# EAGLE design SalinityExpansion (EAGLE 6.1)
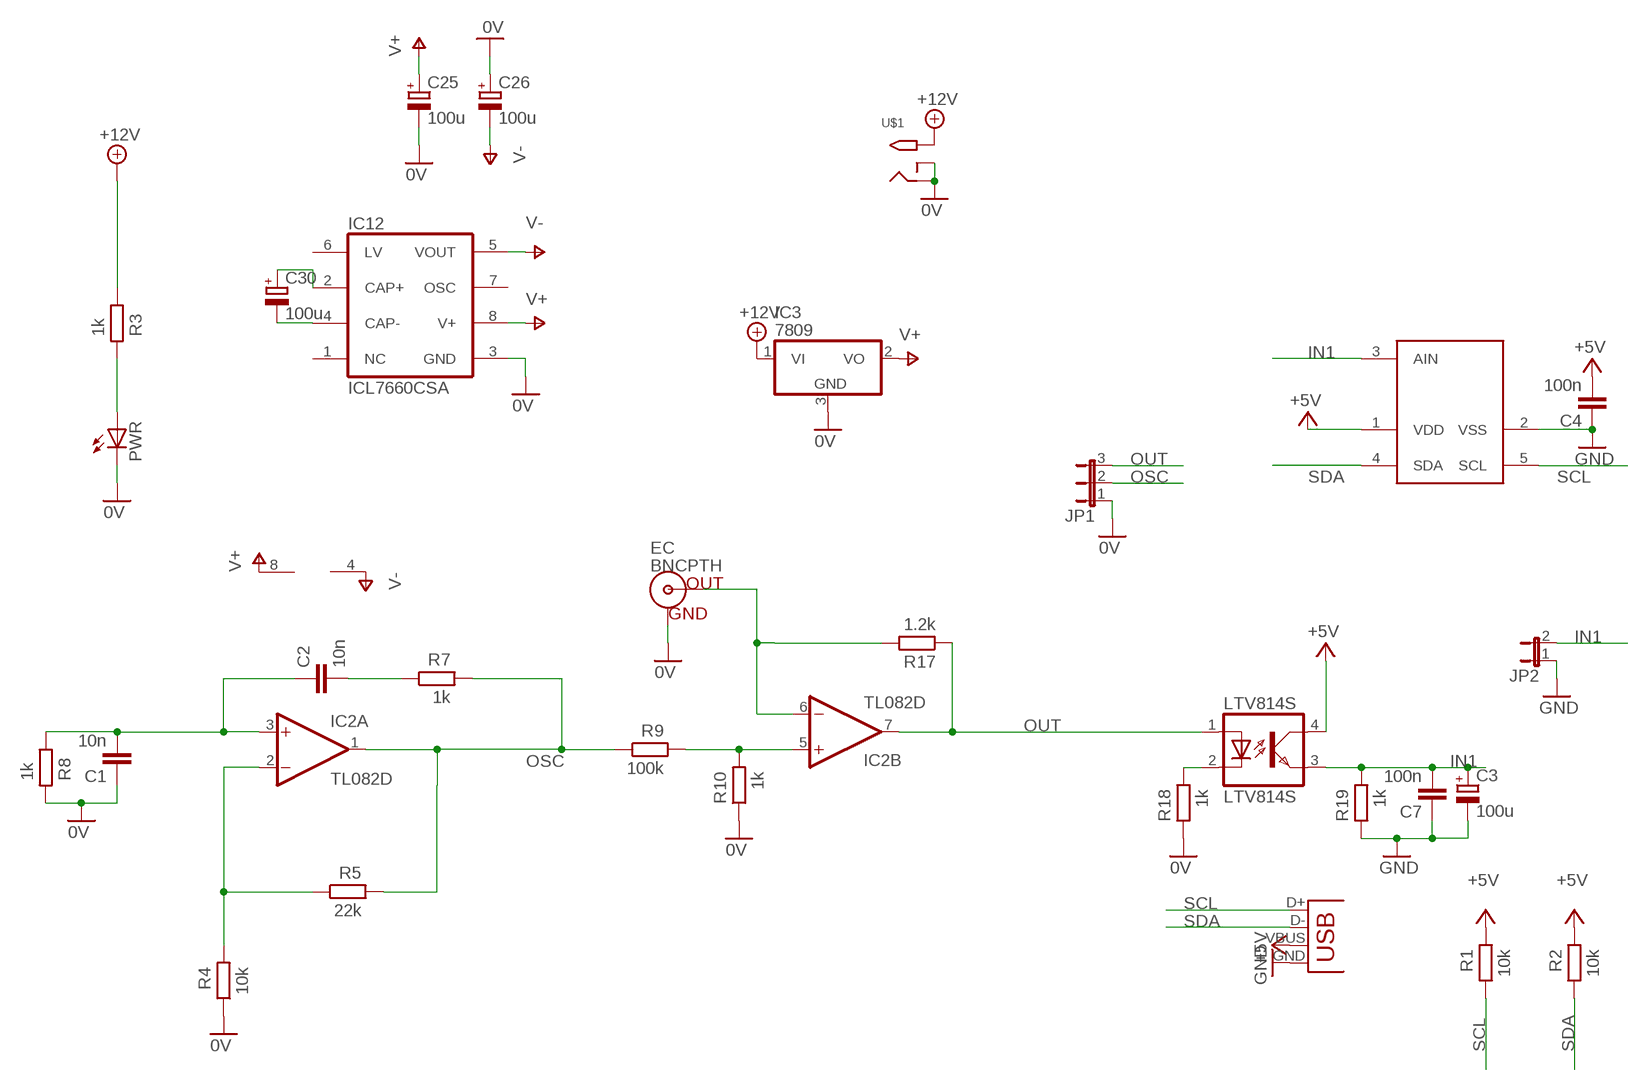
[diagram p0: schematic, sheet 1]

## Parts
C1  10n  C-EUC0805K  [C0805K]
C2  10n  C-EUC0805K  [C0805K]
C3  100u  CPOL-EUD  [PANASONIC_D]
C4  100n  C-EUC0805K  [C0805K]
C7  100n  C-EUC0805K  [C0805K]
C25  100u  CPOL-EUD  [PANASONIC_D]
C26  100u  CPOL-EUD  [PANASONIC_D]
C30  100u  CPOL-EUD  [PANASONIC_D]
EC  BNCPTH  [BNC]
IC2  TL082D  [SO08]
IC3  7809  7805DT  [TO252]
IC12  ICL7660CSA  [SO08]
JP1  JP2E  [JP2]
JP2  JP1E  [JP1]
LTV814S  LTV814S  LTV816S  [SMD4]
PWR  LED3MM  [LED3MM]
R1  10k  R-EU_R0805  [R0805]
R2  10k  R-EU_R0805  [R0805]
R3  1k  R-EU_R0805  [R0805]
R4  10k  R-EU_R0805  [R0805]
R5  22k  R-EU_R0805  [R0805]
R7  1k  R-EU_R0805  [R0805]
R8  1k  R-EU_R0805  [R0805]
R9  100k  R-EU_R0805  [R0805]
R10  1k  R-EU_R0805  [R0805]
R17  1.2k  R-EU_R0805  [R0805]
R18  1k  R-EU_R0805  [R0805]
R19  1k  R-EU_R0805  [R0805]
U$1  2.1MMJACKTHM  [PJ-102A]
U$2  MCP3221  [SOT23-5]
X5  USBSMD  [USB-MINIB]

## Nets
0V: C1.1 C25.- C26.+ EC.GND IC3.3(GND) IC12.3(GND) JP1.1 PWR.K(C) R4.1 R8.2 R10.1 R18.1 U$1.RING U$1.RING_SW
+5V: C4.2 LTV814S.4(COL) R1.2 R2.2 U$2.1(VDD) X5.VBUS
+12V: IC3.1(VI) R3.1 U$1.TIP
GND [gnd]: C3.- C4.1 C7.1 JP2.1 R19.1 U$2.2(VSS) X5.GND
IN1: C3.+ C7.2 JP2.2 LTV814S.3(EMIT) R19.2 U$2.3(AIN)
N$4: IC2.2(A:-IN) R4.2 R5.1
N$8: IC2.5(B:+IN) R9.2 R10.2
N$9: C2.2 R7.1
N$10: PWR.A R3.2
N$11: EC.S(OUT) IC2.6(B:-IN) R17.2
N$12: C1.2 C2.1 IC2.3(A:+IN) R8.1
N$18: LTV814S.2(C) R18.2
N$42: C30.- IC12.4(CAP-)
N$43: C30.+ IC12.2(CAP+)
OSC: IC2.1(A:OUT) JP1.2 R5.2 R7.2 R9.1
OUT: IC2.7(B:OUT) JP1.3 LTV814S.1(A) R17.1
SCL: R1.1 U$2.5(SCL) X5.D+
SDA: R2.1 U$2.4(SDA) X5.D-
V+: C25.+ IC2.8(P:V+) IC3.2(VO) IC12.8(V+)
V-: C26.- IC2.4(P:V-) IC12.5(VOUT)
Unconnected: IC12.1(NC) IC12.6(LV) IC12.7(OSC)

## Library data of the parts
C1 C2 C4 C7 = rcl:C-EU: CAPACITOR, European symbol
C3 C25 C26 C30 = rcl:CPOL-EU: POLARIZED CAPACITOR, European symbol
EC = SparkFun:BNC: BNC Connector, Mouser Part# 5227161
IC2 = linear:TL082: OP AMP
IC3 = adafruit:78*: Positive VOLTAGE REGULATOR Added bigger pads to the TO-92 package
IC12 = maxim:ICL7660CSA: VOLTAGE CONVERTER; MF: MAXIM; MPN: ICL7660CSA; OC_FARNELL: 9724710; OC_NEWARK: 34C3732
JP1 = jumper:JP2E: JUMPER
JP2 = jumper:JP1E: JUMPER
LTV814S = optocoupler:LTV816: OPTO COUPLER Source: LITEON, LTV816.pdf; OC_FARNELL: unknown; OC_NEWARK: unknown
PWR = led:LED: LED OSRAM: - CHIPLED LG R971, LG N971, LY N971, LG Q971, LY Q971, LO R971, LY R971 LH N974, LH R974 LS Q976, LO Q976, LY Q976 LO Q996 - Hyper CHIPLED LW Q18S LB Q993, LB Q99A, LB R99A - SideLED LS A670, LO A670, LY A670, LG A670, LP A670 LB A673, LV A673, LT A673, LW A673 LH A674 LY A675 LS A676, LA A676, LO A676, LY A676, LW A676 LS A679, LY A679, LG A679 - Hyper Micro SIDELED® LS Y876, LA Y876, LO Y876, LY Y876 LT Y87S - SmartLED LW L88C, LW L88S LB L89C, LB L89S, LG L890 LS L89K, LO L89K, LY L89K LS L896, LA L896, LO L896, LY L896 - TOPLED LS T670, LO T670, LY T670, LG T670, LP T670 LSG T670, LSP T670, LSY T670, LOP T670, LYG T670 LG T671, LOG T671, LSG T671 LB T673, LV T673, LT T673, LW T673 LH T674 LS T676, LA T676, LO T676, LY T676, LB T676, LH T676, LSB T676, LW T676 LB T67C, LV T67C, LT T67C, LS T67K, LO T67K, LY T67K, LW E67C LS E67B, LA E67B, LO E67B, LY E67B, LB E67C, LV E67C, LT E67C LW T67C LS T679, LY T679, LG T679 LS T770, LO T770, LY T770, LG T770, LP T770 LB T773, LV T773, LT T773, LW T773 LH T774 LS E675, LA E675, LY E675, LS T675 LS T776, LA T776, LO T776, LY T776, LB T776 LHGB T686 LT T68C, LB T68C - Hyper Mini TOPLED® LB M676 - Mini TOPLED Santana® LG M470 LS M47K, LO M47K, LY M47K Source: http://www.osram.convergy.de LUXEON: - LUMILED® LXK2-PW12-R00, LXK2-PW12-S00, LXK2-PW14-U00, LXK2-PW14-V00 LXK2-PM12-R00, LXK2-PM12-S00, LXK2-PM14-U00 LXK2-PE12-Q00, LXK2-PE12-R00, LXK2-PE12-S00, LXK2-PE14-T00, LXK2-PE14-U00 LXK2-PB12-K00, LXK2-PB12-L00, LXK2-PB12-M00, LXK2-PB14-N00, LXK2-PB14-P00, LXK2-PB14-Q00 LXK2-PR12-L00, LXK2-PR12-M00, LXK2-PR14-Q00, LXK2-PR14-R00 LXK2-PD12-Q00, LXK2-PD12-R00, LXK2-PD12-S00 LXK2-PH12-R00, LXK2-PH12-S00 LXK2-PL12-P00, LXK2-PL12-Q00, LXK2-PL12-R00 Source: www.luxeon.com KINGBRIGHT: KA-3528ASYC Source: www.kingbright.com
R1-R5 R7-R10 R17-R19 = rcl:R-EU_: RESISTOR, European symbol
U$1 = adafruit:2.1MMJACK: 2.1mm x 5.5mm THM DC jack with internal switch. Digikey part #PJ-102A, 4UCON part #05537 2.1mm x 5.5mm SMT DC jack with internal switch. Digikey part #PJ-002A-SMT, 4UCON part #03267 By microbuilder.eu & adafruit.com
U$2 = MCP3426:MCP3221
X5 = SparkFun:USB: USB Connectors USB-B-PTH is fully proven SKU : PRT-00139 USB-miniB is fully proven SKU : PRT-00587 USB-A-PCB is untested. USB-A-H is throughly reviewed, but untested. Spark Fun Electronics SKU : PRT-00437 USB-B-SMT is throughly reviewed, but untested. Needs silkscreen touching up. USB-A-S has not been used/tested USB-MB-H has not been used/tested

## Net classes
0 default: width 0.305 mm, drill 0.305 mm, clearance 0.203 mm
1 power: width 0.254 mm, drill 0.254 mm, clearance 0.229 mm
2 gnd: width 0.305 mm, drill 0.508 mm, clearance 0.203 mm

## Board
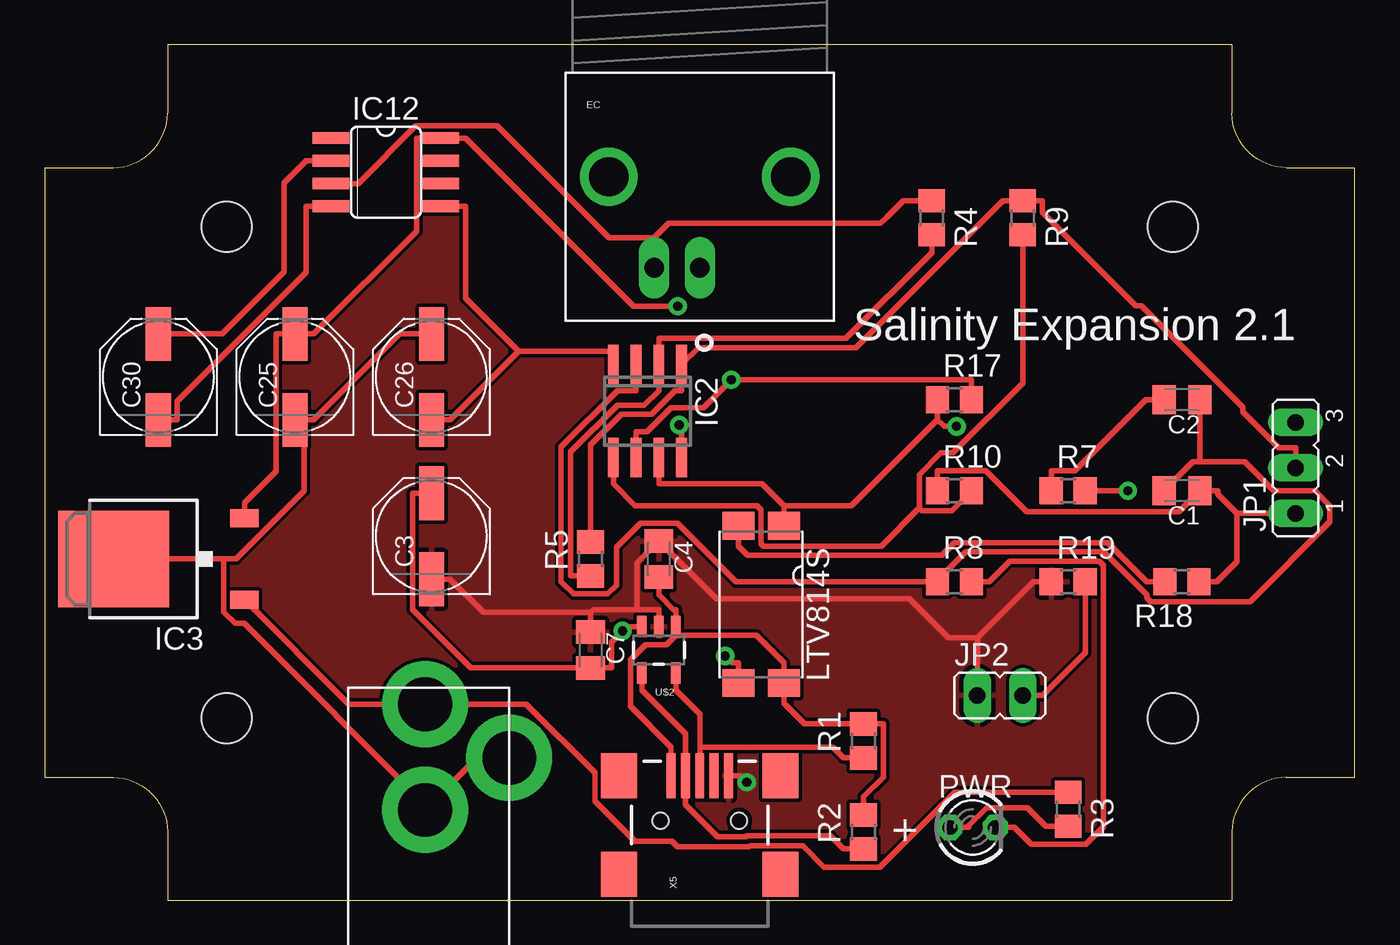
[diagram p1: board, top side]
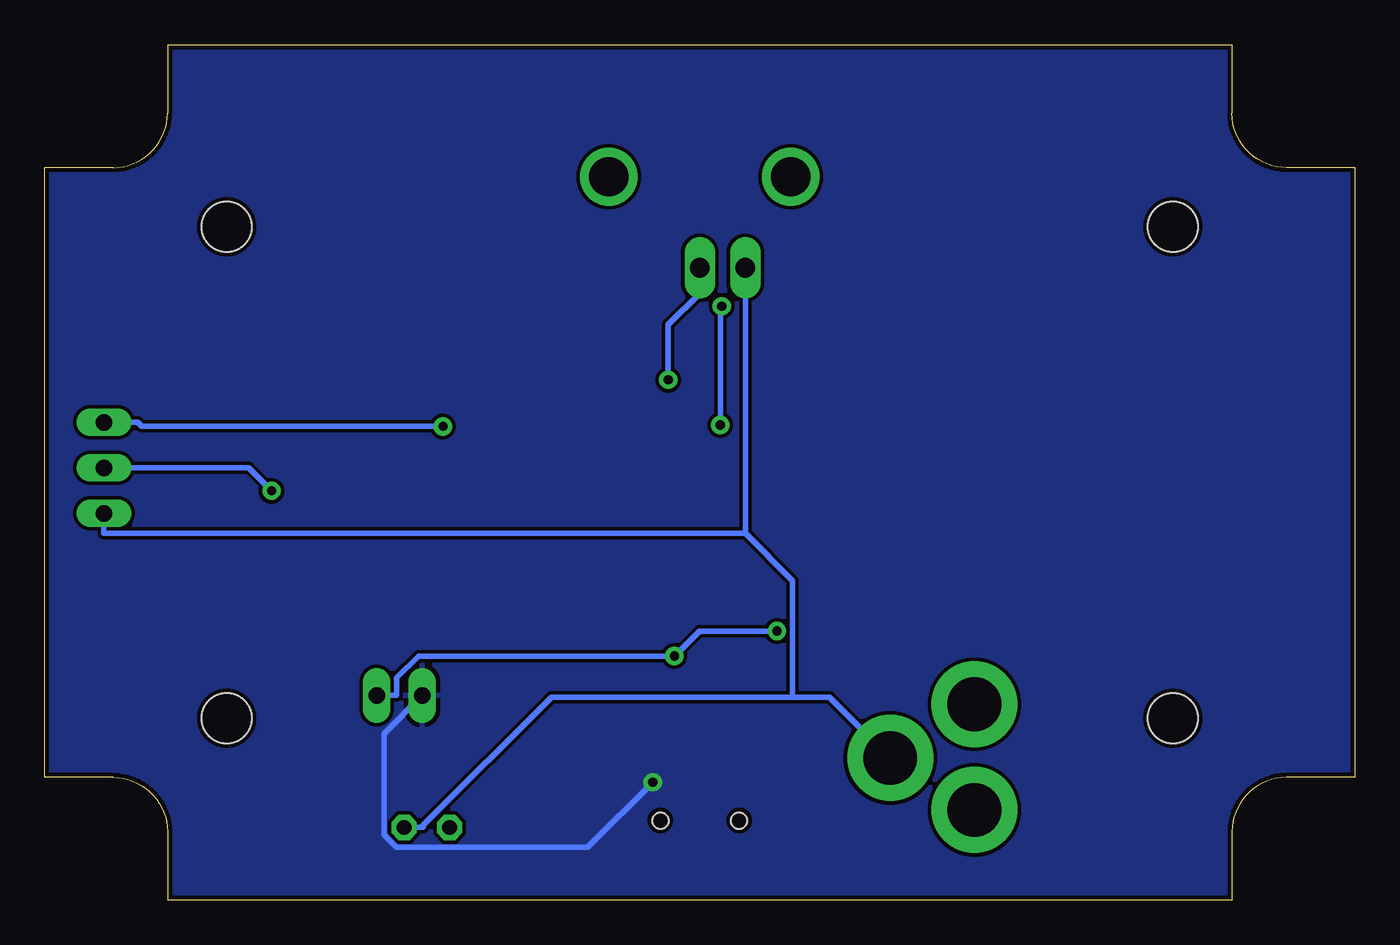
[diagram p2: board, bottom side, seen from below]

Size 73.15 x 47.75 mm. Coordinates in mm from the lower left corner, seen from the top.
Outline: 0,40.89 0,6.86 3.81,6.86 arc-90 6.86,3.81 6.86,0 66.29,0 66.29,3.81 arc-90 69.34,6.86 73.15,6.86 73.15,40.89 69.34,40.89 arc-90 66.29,43.94 66.29,47.75 6.86,47.75 6.86,43.94 arc-90 3.81,40.89 0,40.89
Copper layers (1*16): Top 0.035mm / dielectric 1.5mm / Bottom 0.035mm
Design rules: minimum track width 8mil, minimum drill 20mil, track to track 8mil, track to pad 8mil, pad to pad 8mil, via to via 8mil, smd to smd 8mil, copper to edge 10mil, drill to drill 8mil, minimum pad ring 12mil, minimum via ring 10mil, stop-mask expansion 4mil, vias tented up to drill 25mil, thermal gap 10mil
Holes 2.8 mm at 10.16,10.16 10.16,37.59 62.99,37.59 62.99,10.16

### Footprints (pad centres in the part's own frame; a part is rotated, then mirrored left to right if it is on the bottom)
C0805K = smd 1.3 x 1.6: 1 -1,0; 2 1,0
PANASONIC_D = smd 3 x 1.4: + 2.4,0; - -2.4,0
BNC = drill 2.2: 3 -5.08,5.08; 4 5.08,5.08 | drill 1.1 long: GND -2.54,0; S 0,0
SO08 = smd 0.6 x 2.2: 1 -1.905,-2.6; 2 -0.635,-2.6; 3 0.635,-2.6; 4 1.905,-2.6; 5 1.905,2.6; 6 0.635,2.6; 7 -0.635,2.6; 8 -1.905,2.6
TO252 = smd 1 x 1.6: 1 -2.28,-4.8; 2 2.28,-4.8 | smd 5.4 x 6.2: 3 0,2.5
SO08' = smd 0.66 x 2.032: 1 -1.905,-3.073; 2 -0.635,-3.073; 3 0.635,-3.073; 4 1.905,-3.073; 5 1.905,3.073; 6 0.635,3.073; 7 -0.635,3.073; 8 -1.905,3.073
JP2 = drill 0.914 long: 1 -2.54,0; 2 0,0; 3 2.54,0
JP1 = drill 0.914 long: 1 0,-1.27; 2 0,1.27
SMD4 = smd 1.78 x 1.55: 1 -1.27,-4.389; 2 1.27,-4.389; 3 1.27,4.389; 4 -1.27,4.389
LED3MM = drill 0.813 octagon: A -1.27,0; K 1.27,0
R0805 = smd 1.3 x 1.5: 1 -0.95,0; 2 0.95,0
PJ-102A = drill 3 pad 4.8: RING 0.1,-3.39; RING_SW -4.6,-6.29; TIP 0.1,-9.29
SOT23-5 = smd 0.55 x 1.2: 1 -0.95,-1.3; 2 0,-1.3; 3 0.95,-1.3; 4 0.95,1.3; 5 -0.95,1.3
USB-MINIB = smd 2.5 x 0.5: D+ 2.5,0; D- 2.5,0.8; GND 2.5,-1.6; ID 2.5,-0.8; VBUS 2.5,1.6 | smd 2.5 x 2: GND@1 -3,-4.5; GND@2 -3,4.5; GND@3 2.5,4.5; GND@4 2.5,-4.5 | hole 0.9: 0,2.2; 0,-2.2

### Placement (x,y rotation side)
C1  63.5,22.86 180 top
C2  63.5,27.94 180 top
C3  21.59,20.32 90 top
C4  34.29,19.05 270 top
C7  30.48,13.97 270 top
C25  13.97,29.21 90 top
C26  21.59,29.21 90 top
C30  6.35,29.21 90 top
EC  36.58,35.31 0 top
IC2  33.66,27.3 180 top
IC3  6.35,19.05 90 top
IC12  ICL7660CSA  [SO08']  19.05,40.64 270 top
JP1  69.85,24.13 90 top
JP2  53.34,11.43 270 top
LTV814S  40.01,16.51 180 top
PWR  51.82,4.06 0 top
R1  45.72,8.89 90 top
R2  45.72,3.81 90 top
R3  57.15,5.08 270 top
R4  49.53,38.1 270 top
R5  30.48,19.05 90 top
R7  57.15,22.86 0 top
R8  50.8,17.78 0 top
R9  54.61,38.1 270 top
R10  50.8,22.86 0 top
R17  50.8,27.94 0 top
R18  63.5,17.78 180 top
R19  57.15,17.78 0 top
U$1  21.34,1.65 180 top
U$2  34.29,13.97 180 top
X5  36.58,4.45 90 top

### Tracks (layer width: path | path; a pad name or v marks a point on that pad's centre or on a via)
0V
  Top 0.305: PWR.K 54.15,4.06 55.09,3.12 58.14,3.12 59.11,4.09 59.11,18.7 58.9,18.91 53.89,18.91 52.76,17.78 R8.2 | R10.1 49.85,23.97 52.56,23.97 54.84,21.68 63.32,21.68 C1.1 65.51,22.86 65.51,22.65 66.56,21.59 | 66.56,21.59 68.1,21.59 JP1.1 | 66.56,21.59 66.56,18.89 65.46,17.78 R18.1 | 9.99,19.05 IC3.3 | 14.5,26.81 14.5,22.86 10.69,19.05 9.99,19.05 | 21.38,5.19 11.13,15.45 10.62,15.45 9.99,16.08 9.99,19.05 | 21.38,5.19 U$1.RING | U$1.RING_SW 24.14,7.94 21.38,5.19 | 34.04,36.97 34.84,37.78 46.35,37.78 46.67,37.78 46.99,38.1 47.94,39.05 R4.1 | IC12.3 17.49,40.01 20.71,43.23 25.25,43.23 31.51,36.97 34.04,36.97 | EC.GND 34.04,36.97 | 14.5,26.81 15.03,26.81 19.83,31.61 20.66,31.61 21.13,31.61 C26.+ | C25.- 14.5,26.81
  Bottom 0.305: 31.4,11.34 44.86,11.34 52.02,4.17 52.02,4.06 PWR.K | U$1.RING_SW 29.33,11.34 31.4,11.34 | 31.4,11.34 31.4,17.84 34.04,20.47 | 34.04,20.47 69.85,20.47 JP1.1 | 34.04,20.47 34.04,33.88 EC.GND
+5V
  Top 0.305: 35.24,14.79 39.73,14.79 41.27,13.25 LTV814S.4 41.27,10.99 42.42,9.84 R1.2 46.83,9.84 46.83,6.87 45.72,5.77 R2.2 | X5.VBUS 34.98,8.55 32.71,10.82 32.71,13.43 33.55,14.27 34.71,14.27 35.24,14.79 | 35.24,14.79 U$2.1 35.24,16.23 35.11,16.23 34.29,17.04 C4.2
+12V
  Top 0.305: IC3.1 16.98,10.94 U$1.TIP 26.89,10.94 30.72,7.11 30.72,5.52 32.96,3.28 35.03,3.28 35.34,2.97 39.33,2.97 39.4,3.05 42.33,3.05 43.52,1.85 46.64,1.85 50.82,6.03 R3.1
GND  (via drill 0.51 pad 1.02)
  Top 0.305: 33.07,16.23 30.63,16.23 30.48,16.07 | 33.07,16.23 34.29,16.23 U$2.2 | 33.07,16.23 33.07,18.83 C4.1 37.52,16.82 48.29,16.82 50.46,14.66 52.07,14.66 | 30.48,16.07 24.49,16.07 22.65,17.92 C3.- | 30.48,16.07 30.48,15.98 C7.1 | 52.07,14.66 55.19,17.78 R19.1 | JP2.1 52.07,14.66 | X5.GND 38.84,6.95 v39.2,6.58
  Bottom 0.305: v39.2,6.58 42.83,2.95 53.5,2.95 54.2,3.65 54.2,9.3 JP2.1
  pour Bottom: -2.54,53.34 77.47,53.34 77.47,-2.54 -2.54,-2.54
  pour Top: -1.27,52.07 74.93,52.07 74.93,-1.27 -1.27,-1.27
IN1  (via drill 0.51 pad 1.02)
  Top 0.305: v37.99,13.63 38.37,13.25 38.73,13.25 LTV814S.3 | U$2.3 32.51,15.27 v32.27,15.03 31.64,14.39 31.64,12.97 C7.2 23.78,12.97 20.53,16.22 20.53,22.72 C3.+ | JP2.2 55.73,11.43 58.1,13.8 R19.2
  Bottom 0.305: v32.27,15.03 36.6,15.03 v37.99,13.63 52.27,13.63 53.49,12.41 53.49,11.43 JP2.2
N$4
  Top 0.305: R5.1 29.37,18.1 29.37,25.04 31.97,27.63 33.47,27.63 34.29,28.45 IC2.2 34.29,31.36 44.75,31.36 49.53,36.14 R4.2
N$8
  Top 0.305: 48.84,21.9 48.84,23.76 50.05,24.97 50.72,24.97 54.61,28.86 R9.2 | R10.2 50.65,21.75 48.99,21.75 48.84,21.9 | 48.84,21.9 46.71,19.77 40.13,19.77 40.01,19.89 40.01,21.8 39.77,22.03 32.97,22.03 31.75,23.25 IC2.5
N$9
  Top 0.305: C2.2 61.49,27.94 57.52,23.97 56.2,23.97 R7.1
N$10
  Top 0.305: PWR.A 51.61,4.06 51.61,4.17 52.6,5.16 54.88,5.16 55.91,4.13 R3.2
N$11  (via drill 0.51 pad 1.02)
  Top 0.305: IC2.6 33.02,26.16 33.64,26.16 34.97,27.49 36.78,27.49 v38.34,29.05 51.75,29.05 R17.2
  Bottom 0.305: EC.S 36.58,33.88 38.34,32.12 v38.34,29.05
N$12
  Top 0.305: 64.5,24.48 67.01,24.48 68.63,22.86 70.94,22.86 71.77,22.03 71.77,21.13 67.31,16.67 61.75,16.67 61.54,16.88 61.54,17.05 59.15,19.45 51.44,19.45 49.85,17.86 R8.1 38.6,17.78 35.33,21.06 33.28,21.06 31.93,19.7 31.93,17.59 31.43,17.09 29.53,17.09 28.84,17.79 28.84,25.31 31.98,28.45 33.02,28.45 IC2.3 | C1.2 64.12,24.48 64.5,24.48 | 64.5,24.48 64.5,26.78 C2.1
N$18
  Top 0.305: LTV814S.2 38.73,19.77 39.24,19.26 50.09,19.26 50.79,19.96 59.37,19.96 61.54,17.78 R18.2
N$42
  Top 0.305: C30.- 7.41,26.81 7.41,27.87 14.61,35.06 14.61,38.73 IC12.4
N$43
  Top 0.305: IC12.2 14.61,41.27 13.37,40.04 13.37,35.08 9.91,31.61 C30.+
OSC  (via drill 0.51 pad 1.02)
  Top 0.305: R7.2 59.11,22.86 v60.49,22.86 | JP1.2 69.85,25.25 68.92,25.25 66.9,27.28 66.9,27.52 61.24,33.18 60.93,33.18 55.72,38.39 55.72,39.05 R9.1 54.06,39.05 53.5,39.05 45.31,30.85 36.51,30.85 IC2.1 35.56,28.45 35.21,28.45 33.88,27.12 32.19,27.12 30.48,25.41 30.48,21.01 R5.2
  Bottom 0.305: JP1.2 61.76,24.13 v60.49,22.86
OUT  (via drill 0.51 pad 1.02)
  Top 0.305: 41.27,22.03 40.05,23.25 34.29,23.25 IC2.7 | 49.85,26.83 45.05,22.03 41.27,22.03 | 49.85,26.83 50.24,26.45 v50.92,26.45 | R17.1 49.85,26.83 | LTV814S.1 41.27,22.03
  Bottom 0.305: v50.92,26.45 67.75,26.45 67.97,26.67 JP1.3
SCL
  Top 0.305: U$2.5 35.24,11.71 36.58,10.38 36.58,8.55 | R1.1 44.61,7.94 44,8.55 36.58,8.55 | X5.D+ 36.58,8.55
SDA
  Top 0.305: R2.1 44.61,2.86 43.88,3.59 39.22,3.59 39.17,3.54 37.58,3.54 35.78,5.34 X5.D- 35.78,9.28 33.34,11.71 U$2.4
V+  (via drill 0.51 pad 1.02)
  Top 0.305: v35.35,33.16 32.88,33.16 23.5,42.55 22.68,42.55 IC12.8 20.75,42.55 20.75,37.34 15.03,31.61 C25.+ 12.91,31.61 12.91,23.95 11.15,22.19 IC3.2 | v35.43,26.53 35.56,26.4 IC2.8
  Bottom 0.305: v35.43,26.53 35.43,33.08 v35.35,33.16
V-
  Top 0.305: IC12.5 23.5,38.73 23.5,33.61 26.47,30.63 | 26.47,30.63 22.65,26.81 C26.- | 26.47,30.63 31.75,30.63 IC2.4

### Text on the board
tPlace: Salinity Expansion 2.1
tNames: +